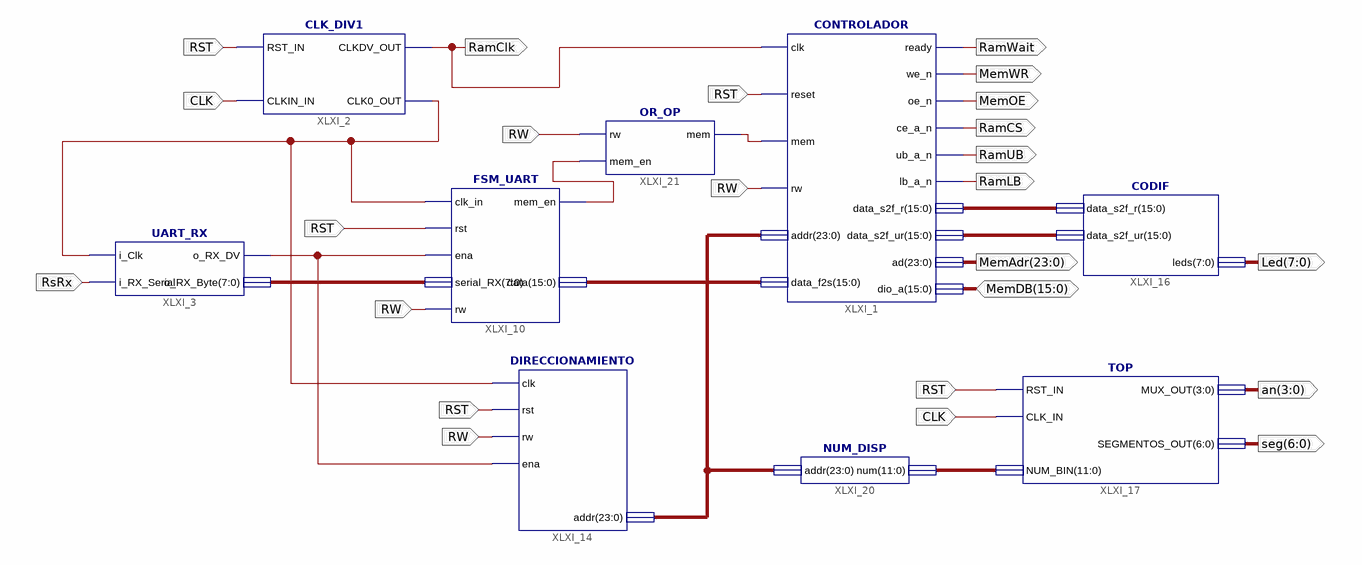
[diagram p0: schematic sheet 1]
// Xilinx ISE schematic TOP_IMPLEMENTACION.sch (spartan3e) as structural Verilog: 9 symbols, 16 ports
module TOP_IMPLEMENTACION (
  input  CLK,
  input  RsRx,
  input  RW,
  input  RST,
  inout  [15:0] MemDB,
  output RamClk,
  output MemWR,
  output MemOE,
  output RamCS,
  output RamUB,
  output RamLB,
  output RamWait,
  output [23:0] MemAdr,
  output [3:0] an,
  output [6:0] seg,
  output [7:0] Led
);

  wire XLXN_41, XLXN_70, XLXN_96, XLXN_97;
  wire [7:0] XLXN_37;
  wire [11:0] XLXN_91;
  wire [15:0] XLXN_40, XLXN_76, XLXN_77;
  wire [23:0] XLXN_64;

  CLK_DIV1 XLXI_2 (.CLKIN_IN(CLK), .RST_IN(RST), .CLKDV_OUT(RamClk), .CLK0_OUT(XLXN_41));
  UART_RX XLXI_3 (.i_Clk(XLXN_41), .i_RX_Serial(RsRx), .o_RX_DV(XLXN_70), .o_RX_Byte(XLXN_37));
  FSM_UART XLXI_10 (
    .clk_in(XLXN_41), .rst(RST), .ena(XLXN_70), .rw(RW), .serial_RX(XLXN_37), .mem_en(XLXN_96), .data(XLXN_40));
  CONTROLADOR XLXI_1 (
    .clk(RamClk), .reset(RST), .mem(XLXN_97), .rw(RW), .addr(XLXN_64), .data_f2s(XLXN_40), .dio_a(MemDB),
    .ready(RamWait), .we_n(MemWR), .oe_n(MemOE), .ce_a_n(RamCS), .ub_a_n(RamUB), .lb_a_n(RamLB),
    .data_s2f_r(XLXN_76), .data_s2f_ur(XLXN_77), .ad(MemAdr));
  DIRECCIONAMIENTO XLXI_14 (.clk(XLXN_41), .rst(RST), .rw(RW), .ena(XLXN_70), .addr(XLXN_64));
  CODIF XLXI_16 (.data_s2f_r(XLXN_76), .data_s2f_ur(XLXN_77), .leds(Led));
  TOP XLXI_17 (.CLK_IN(CLK), .NUM_BIN(XLXN_91), .RST_IN(RST), .MUX_OUT(an), .SEGMENTOS_OUT(seg));
  NUM_DISP XLXI_20 (.addr(XLXN_64), .num(XLXN_91));
  OR_OP XLXI_21 (.rw(RW), .mem_en(XLXN_96), .mem(XLXN_97));
endmodule
